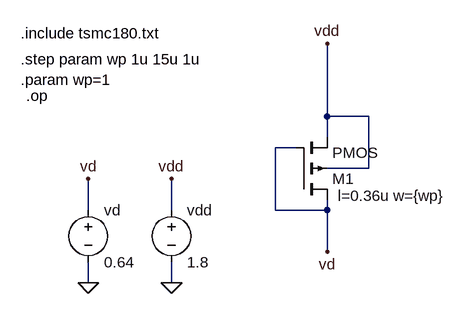
[diagram p0: schematic current mirror model pmos.asc]
current mirror model pmos.asc, the LTspice schematic file:
Version 4
SHEET 1 880 680
WIRE 64 80 64 -32
WIRE 128 80 64 80
WIRE 64 112 64 80
WIRE 16 128 -16 128
WIRE 128 160 128 80
WIRE 128 160 64 160
WIRE -304 224 -304 176
WIRE -176 224 -176 176
WIRE -16 224 -16 128
WIRE 64 224 64 208
WIRE 64 224 -16 224
WIRE 64 288 64 224
WIRE -304 336 -304 304
WIRE -176 336 -176 304
FLAG -176 336 0
FLAG -176 176 vdd
FLAG -304 176 vd
FLAG -304 336 0
FLAG 64 288 vd
FLAG 64 -32 vdd
SYMBOL voltage -176 208 R0
WINDOW 123 0 0 Left 0
WINDOW 39 0 0 Left 0
SYMATTR InstName vdd
SYMATTR Value 1.8
SYMBOL pmos4 16 208 M180
WINDOW 123 64 6 Left 2
SYMATTR Value2 l=0.36u w={wp}
SYMATTR InstName M1
SYMBOL voltage -304 208 R0
WINDOW 123 0 0 Left 0
WINDOW 39 0 0 Left 0
SYMATTR InstName vd
SYMATTR Value 0.64
TEXT -400 48 Left 2 !.op
TEXT -408 -48 Left 2 !.include tsmc180.txt
TEXT -408 -8 Left 2 !.step param wp 1u 15u 1u\n.param wp=1

The netlist it stands for:
* current mirror model pmos.asc
vdd vdd 0 1.8
M1 vd vd vdd vdd PMOS l=0.36u w={wp}
vd vd 0 0.64
.model NMOS NMOS
.model PMOS PMOS
.lib standard.mos
.op
.include tsmc180.txt
.step param wp 1u 15u 1u
.param wp=1
.backanno
.end